# Altium schematic sheet Sheet3-key.SchDoc
size A3; SheetNumber: 6; SheetTotal: 6
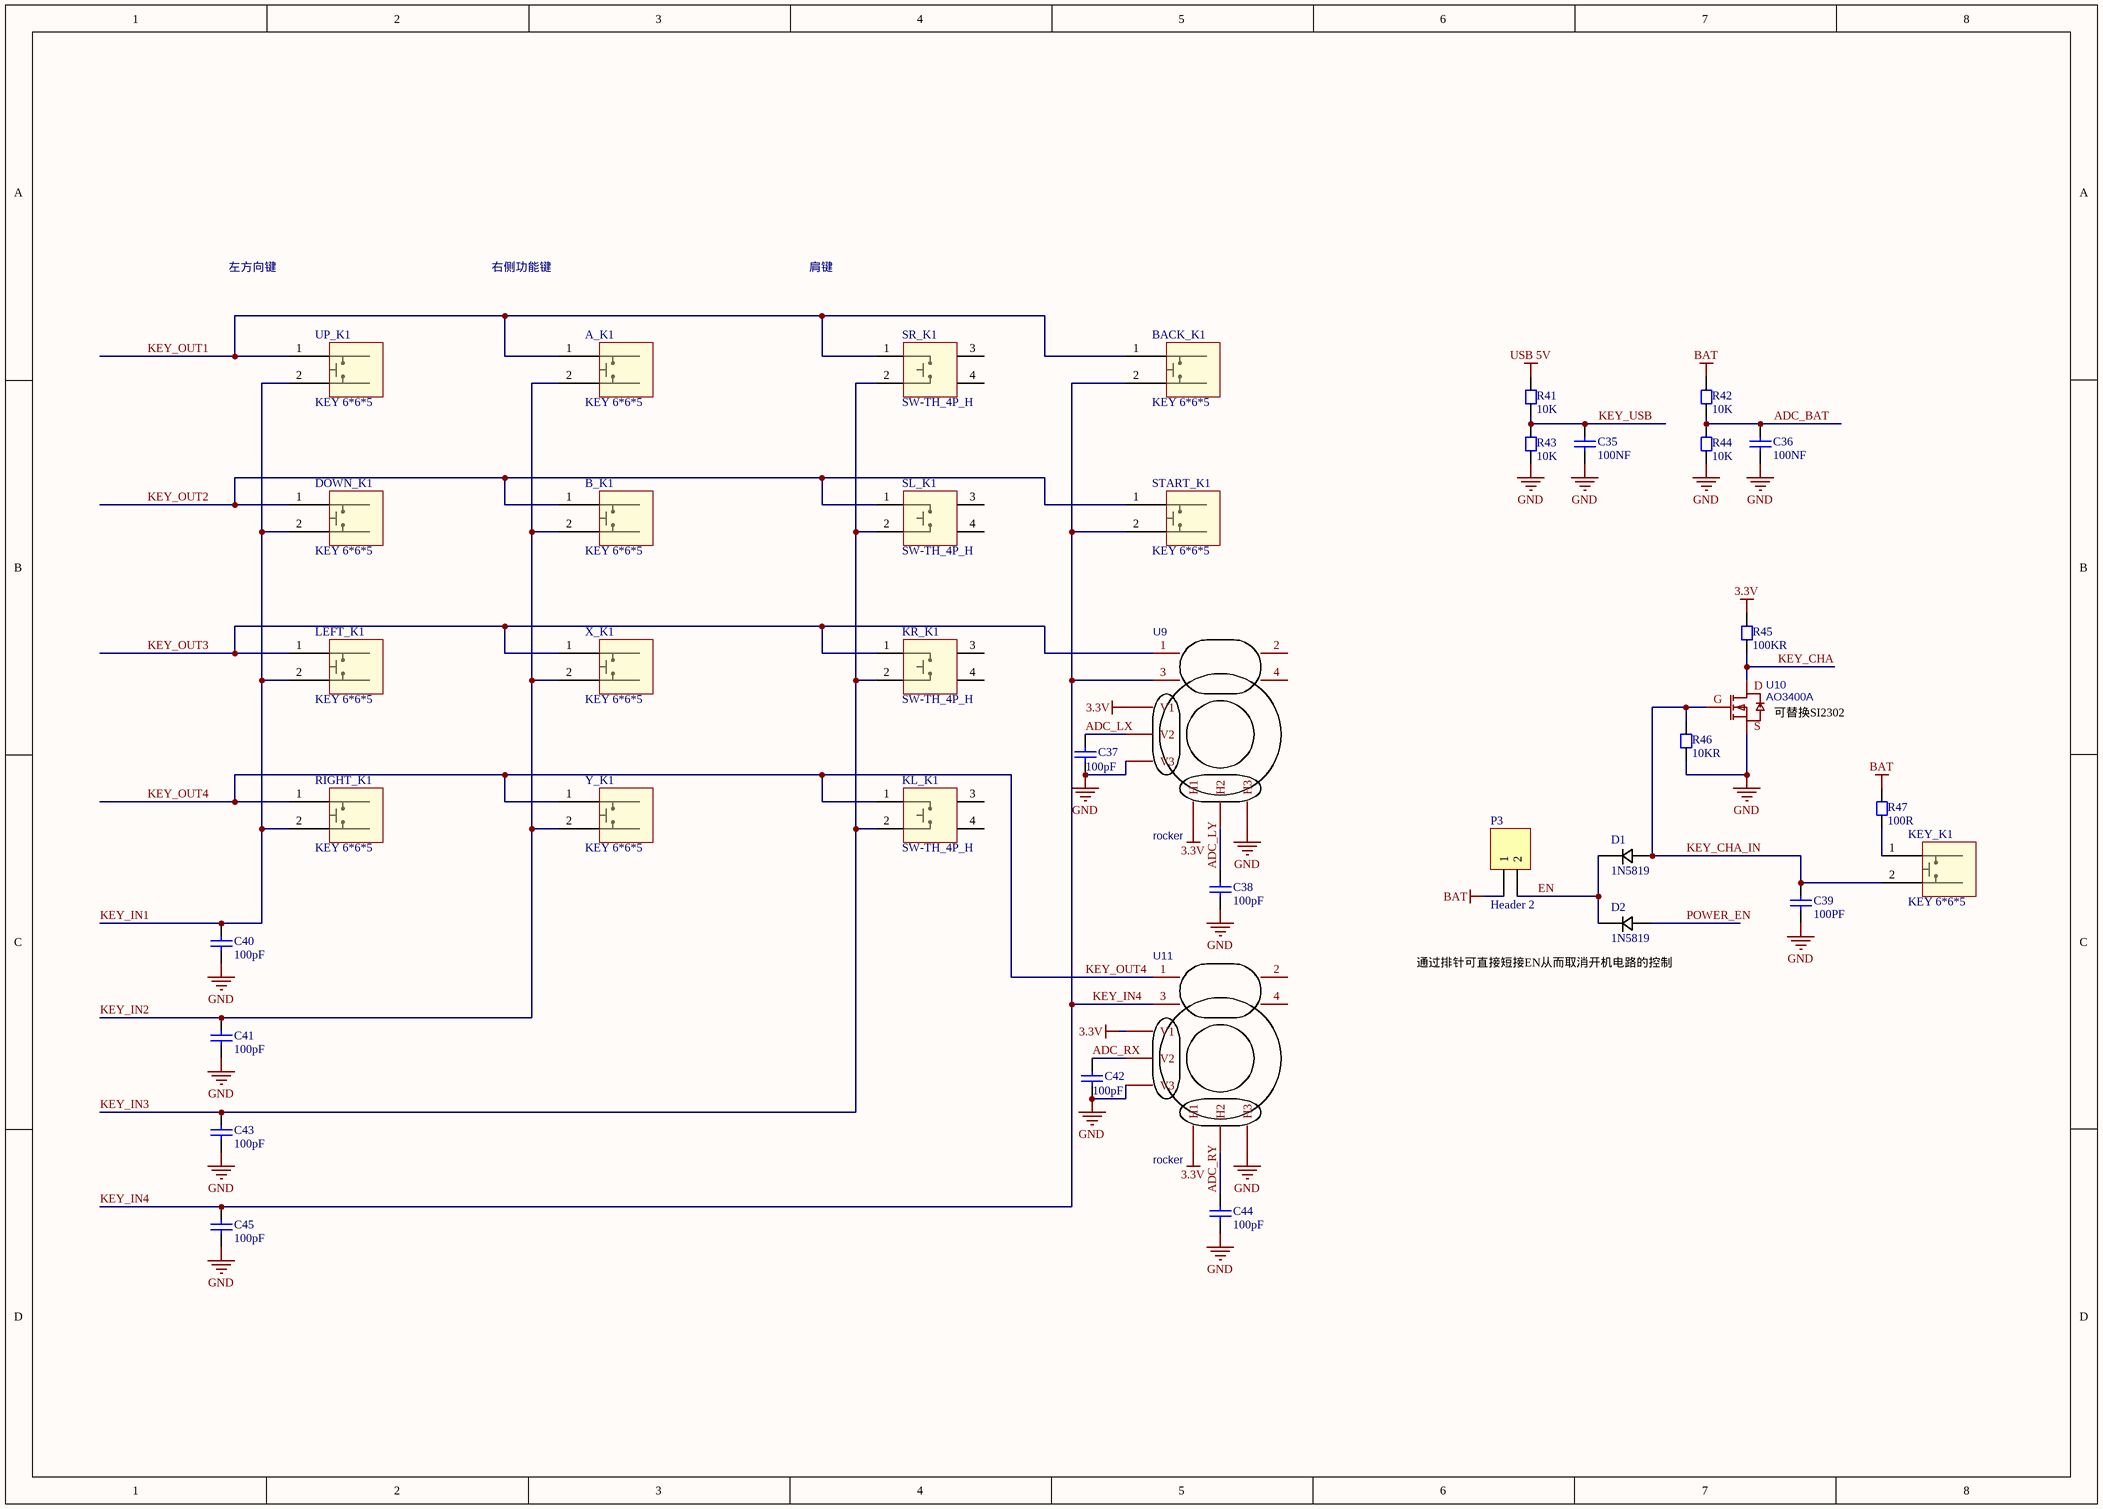
[diagram p0: Sheet3-key.SchDoc]

## Parts
A_K1  KEY 6*6*5  [KEY 6*6*5]
B_K1  KEY 6*6*5  [KEY 6*6*5]
BACK_K1  KEY 6*6*5  [KEY 6*6*5]
C35  100NF  [CC1608-0603]
C36  100NF  [CC1608-0603]
C37  100pF  [CC1608-0603]
C38  100pF  [CC1608-0603]
C39  100PF  [CC1608-0603]
C40  100pF  [CC1608-0603]
C41  100pF  [CC1608-0603]
C42  100pF  [CC1608-0603]
C43  100pF  [CC1608-0603]
C44  100pF  [CC1608-0603]
C45  100pF  [CC1608-0603]
D1  1N5819  [SOD-323_L1.8-W1.3-LS2.5-RD]
D2  1N5819  [SOD-323_L1.8-W1.3-LS2.5-RD]
DOWN_K1  KEY 6*6*5  [KEY 6*6*5]
KEY_K1  KEY 6*6*5  [KEY 6*6*5]
KL_K1  SW-TH_4P_H  [SW-TH_KH-6X6X7H-ZJ]
KR_K1  SW-TH_4P_H  [SW-TH_KH-6X6X7H-ZJ]
LEFT_K1  KEY 6*6*5  [KEY 6*6*5]
P3  Header 2  [HDR1X2]
R41  10K  [CR1608-0603]
R42  10K  [CR1608-0603]
R43  10K  [CR1608-0603]
R44  10K  [CR1608-0603]
R45  100KR  [CR1608-0603]
R46  10KR  [CR1608-0603]
R47  100R  [CR1608-0603]
RIGHT_K1  KEY 6*6*5  [KEY 6*6*5]
SL_K1  SW-TH_4P_H  [SW-TH_KH-6X6X7H-ZJ]
SR_K1  SW-TH_4P_H  [SW-TH_KH-6X6X7H-ZJ]
START_K1  KEY 6*6*5  [KEY 6*6*5]
U9  rocker  [PCBComponent_1]
U10  AO3400A  [SOT-23]
U11  rocker  [PCBComponent_1]
UP_K1  KEY 6*6*5  [KEY 6*6*5]
X_K1  KEY 6*6*5  [KEY 6*6*5]
Y_K1  KEY 6*6*5  [KEY 6*6*5]

## Nets
3.3V: R45.2 U9.5(V1) U9.8(H1) U11.5(V1) U11.8(H1)
BAT: P3.1 R42.2 R47.1
GND: C35.1 C36.1 C37.1 C38.1 C39.2 C40.1 C41.1 C42.1 C43.1 C44.1 C45.1 R43.1 R44.1 R46.1 U9.7(V3) U9.10(H3) U10.2(S) U11.7(V3) U11.10(H3)
USB 5V: R41.2
ADC_BAT: C36.2 R42.1 R44.2
ADC_LX: C37.2 U9.6(V2)
ADC_LY: C38.2 U9.9(H2)
ADC_RX: C42.2 U11.6(V2)
ADC_RY: C44.2 U11.9(H2)
EN: D1.1 D2.1 P3.2
KEY_CHA: R45.1 U10.3(D)
KEY_CHA_IN: C39.1 D1.2 KEY_K1.2 R46.2 U10.1(G)
KEY_IN1: C40.2 DOWN_K1.2 LEFT_K1.2 RIGHT_K1.2 UP_K1.2
KEY_IN2: A_K1.2 B_K1.2 C41.2 X_K1.2 Y_K1.2
KEY_IN3: C43.2 KL_K1.2 KR_K1.2 SL_K1.2 SR_K1.2
KEY_IN4: BACK_K1.2 C45.2 START_K1.2 U9.3 U11.3
KEY_OUT1: A_K1.1 BACK_K1.1 SR_K1.1 UP_K1.1
KEY_OUT2: B_K1.1 DOWN_K1.1 SL_K1.1 START_K1.1
KEY_OUT3: KR_K1.1 LEFT_K1.1 U9.1 X_K1.1
KEY_OUT4: KL_K1.1 RIGHT_K1.1 U11.1 Y_K1.1
KEY_USB: C35.2 R41.1 R43.2
POWER_EN: D2.2
NetKEY_K1_1: KEY_K1.1 R47.2

Not connected (* = marked no-connect by the designer): KL_K1 3 4; KR_K1 3 4; SL_K1 3 4; SR_K1 3 4; U9 2 4; U11 2 4

## Notes on the sheet
- 左方向键
- 右侧功能键
- 肩键
- (near U10) 可替换SI2302
- 通过排针可直接短接EN从而取消开机电路的控制

## Library data of the parts
A_K1 B_K1 BACK_K1 DOWN_K1 KEY_K1 LEFT_K1 RIGHT_K1 START_K1 UP_K1 X_K1 Y_K1 = KEY 6*6*5: 无声轻触开关
C35-C45 = Cap Chip 0603: 0603封装的电容; Published: 8-Jun-2000; Revision: July-2002: Re-released for DXP Platform.; Publisher: Altium Limited
D1 D2 = 1N5819: 肖特基二极管
KL_K1 KR_K1 SL_K1 SR_K1 = SW-TH_4P_H: 卧式轻触开关
P3 = Header 2: Header, 2-Pin; LatestRevisionDate: 17-Jul-2002; LatestRevisionNote: Re-released for DXP Platform.; Publisher: Altium Limited
R41-R44 R47 = Resistor Chip 0603: 0603封装电阻; Published: 8-Jun-2000; Revision: July-2002: Re-released for DXP Platform.; Publisher: Altium Limited
R45 R46 = Chip resistor: 贴片电阻
U9 U11 = rocker: Manufacturer Part: 摇杆; Contributor: Alex_Ai; spicePre: U; spiceSymbolName: 摇杆_直插_圆半径13_10电气脚_4固定脚 COPY
U10 = AO3400A: UMW AO3400A SOT-23 30V/5.8A N沟道 MOS(场效应管)芯片; Manufacturer: ElecSuper(静芯微）; Manufacturer Part: AO3401A; Contributor: lcsc; Supplier: LCSC; Supplier Part: C5224202; JLCPCB Part Class: Extended Part; link: https://so.szlcsc.com/global.html?k=C5224202&ref=editor; spicePre: U; spiceSymbolName: AO3401A_C5224202